# EAGLE design telephon (EAGLE 6.6.0)
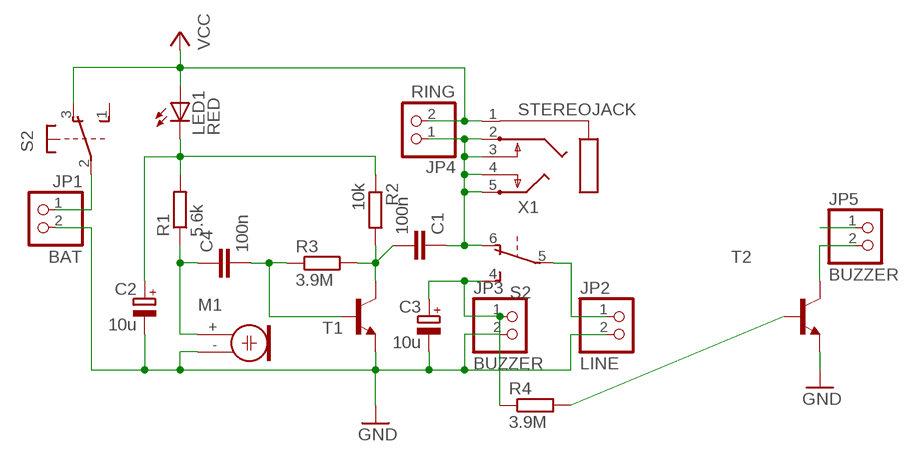
[diagram p0: schematic, sheet 1]

## Parts
C1  100n  C-EU025-025X050  [C025-025X050]
C2  10u  CPOL-EUB45181A  [B45181A]
C3  10u  CPOL-EUB45181A  [B45181A]
C4  100n  C-EU025-025X050  [C025-025X050]
JP1  BAT  PINHD-1X2  [1X02]
JP2  LINE  PINHD-1X2  [1X02]
JP3  BUZZER  PINHD-1X2  [1X02]
JP4  RING  PINHD-1X2  [1X02]
JP5  BUZZER  PINHD-1X2  [1X02]
LED1  RED  LED5MM  [LED5MM]
M1  ELECTRET  [9.7ELECTRET]
R1  5.6k  R-EU_0204/7  [0204/7]
R2  10k  R-EU_0204/7  [0204/7]
R3  3.9M  R-EU_0204/7  [0204/7]
R4  3.9M  R-EU_0204/7  [0204/7]
S2  9450-2  [9450-2]
T1  BC547-NPN-TO92-CBE  [TO92-CBE]
T2  BC547-NPN-TO92-CBE  [TO92-CBE]
X1  STEREOJACK  [STX3100]

## Nets
GND: C2.- C3.- JP1.2 JP2.2 JP3.2 M1.- T1.E T2.E
N$1: C3.+ JP3.1 R4.1 S2.4(2:S)
N$2: JP5.2 T2.C
N$3: R4.2 T2.B
N$4: C4.2 R3.1 T1.B
N$5: C4.1 M1.+ R1.1
N$6: C1.2 R2.2 R3.2 T1.C
N$7: JP5.1
N$8: C1.1 JP4.1 S2.6(2:O) X1.2 X1.3 X1.4 X1.5
N$9: C2.+ LED1.K(C) R1.2 R2.1
N$11: JP2.1 S2.5(2:P)
N$12: JP1.1 S2.2(1:P)
VCC: JP4.2 LED1.A S2.3(1:O) X1.1
Unconnected: S2.1(1:S)

## Library data of the parts
C1 C4 = rcl:C-EU: CAPACITOR, European symbol
C2 C3 = rcl:CPOL-EU: POLARIZED CAPACITOR, European symbol
JP1-JP5 = pinhead:PINHD-1X2: PIN HEADER
LED1 = led:LED: LED OSRAM: - CHIPLED LG R971, LG N971, LY N971, LG Q971, LY Q971, LO R971, LY R971 LH N974, LH R974 LS Q976, LO Q976, LY Q976 LO Q996 - Hyper CHIPLED LW Q18S LB Q993, LB Q99A, LB R99A - SideLED LS A670, LO A670, LY A670, LG A670, LP A670 LB A673, LV A673, LT A673, LW A673 LH A674 LY A675 LS A676, LA A676, LO A676, LY A676, LW A676 LS A679, LY A679, LG A679 - Hyper Micro SIDELED® LS Y876, LA Y876, LO Y876, LY Y876 LT Y87S - SmartLED LW L88C, LW L88S LB L89C, LB L89S, LG L890 LS L89K, LO L89K, LY L89K LS L896, LA L896, LO L896, LY L896 - TOPLED LS T670, LO T670, LY T670, LG T670, LP T670 LSG T670, LSP T670, LSY T670, LOP T670, LYG T670 LG T671, LOG T671, LSG T671 LB T673, LV T673, LT T673, LW T673 LH T674 LS T676, LA T676, LO T676, LY T676, LB T676, LH T676, LSB T676, LW T676 LB T67C, LV T67C, LT T67C, LS T67K, LO T67K, LY T67K, LW E67C LS E67B, LA E67B, LO E67B, LY E67B, LB E67C, LV E67C, LT E67C LW T67C LS T679, LY T679, LG T679 LS T770, LO T770, LY T770, LG T770, LP T770 LB T773, LV T773, LT T773, LW T773 LH T774 LS E675, LA E675, LY E675, LS T675 LS T776, LA T776, LO T776, LY T776, LB T776 LHGB T686 LT T68C, LB T68C - Hyper Mini TOPLED® LB M676 - Mini TOPLED Santana® LG M470 LS M47K, LO M47K, LY M47K Source: http://www.osram.convergy.de LUXEON: - LUMILED® LXK2-PW12-R00, LXK2-PW12-S00, LXK2-PW14-U00, LXK2-PW14-V00 LXK2-PM12-R00, LXK2-PM12-S00, LXK2-PM14-U00 LXK2-PE12-Q00, LXK2-PE12-R00, LXK2-PE12-S00, LXK2-PE14-T00, LXK2-PE14-U00 LXK2-PB12-K00, LXK2-PB12-L00, LXK2-PB12-M00, LXK2-PB14-N00, LXK2-PB14-P00, LXK2-PB14-Q00 LXK2-PR12-L00, LXK2-PR12-M00, LXK2-PR14-Q00, LXK2-PR14-R00 LXK2-PD12-Q00, LXK2-PD12-R00, LXK2-PD12-S00 LXK2-PH12-R00, LXK2-PH12-S00 LXK2-PL12-P00, LXK2-PL12-Q00, LXK2-PL12-R00 Source: www.luxeon.com KINGBRIGHT: KA-3528ASYC Source: www.kingbright.com
M1 = adafruit:ELECTRET: Electret microphone Thru hole 2.54mm spacing with 9.7mm diameter
R1-R4 = rcl:R-EU_: RESISTOR, European symbol
S2 = switch-misc:9450-2: MARQUARDT SWITCH
T1 T2 = transistor:*-NPN-: NPN Transistror BF959 corrected 2008.03.06
X1 = adafruit:STEREOJACK: MIC/HEADPHONE JACK Stereo jack with two switches. Kycon STX3100, CUI SJ1-3555NG and/or 4UCon 05544

## Board
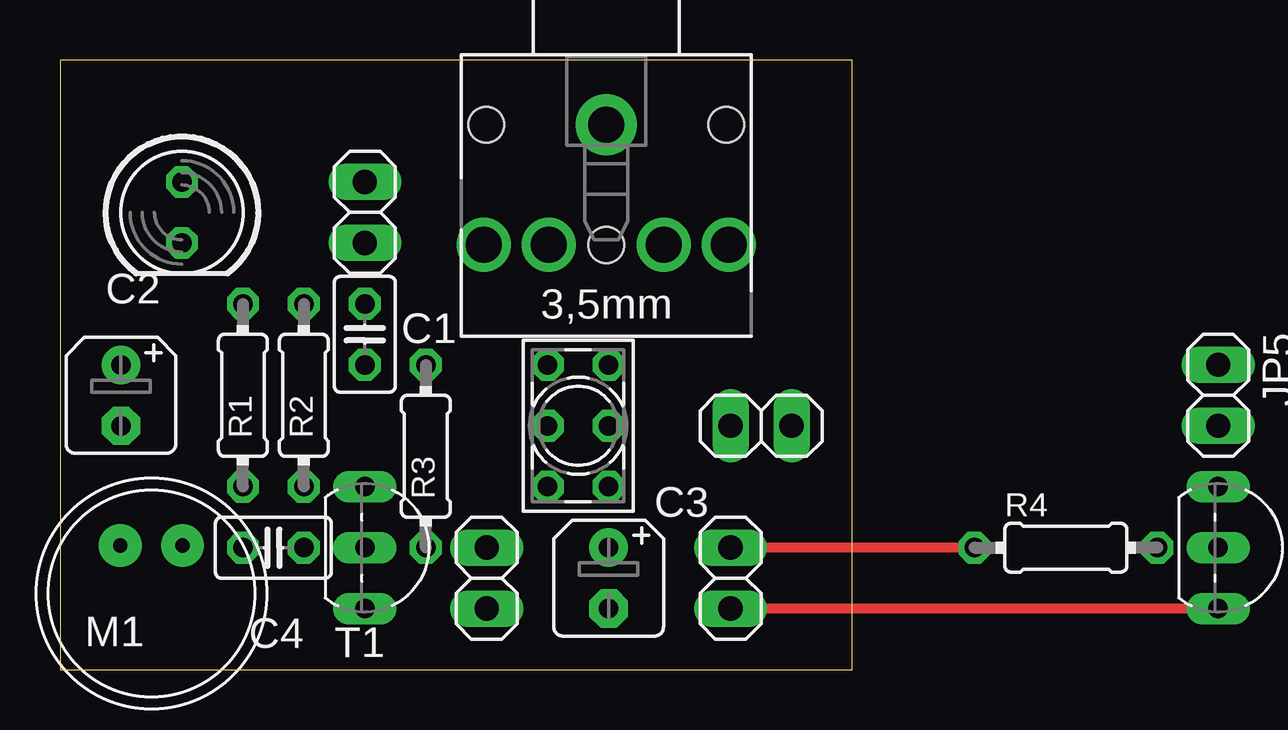
[diagram p1: board, top side]
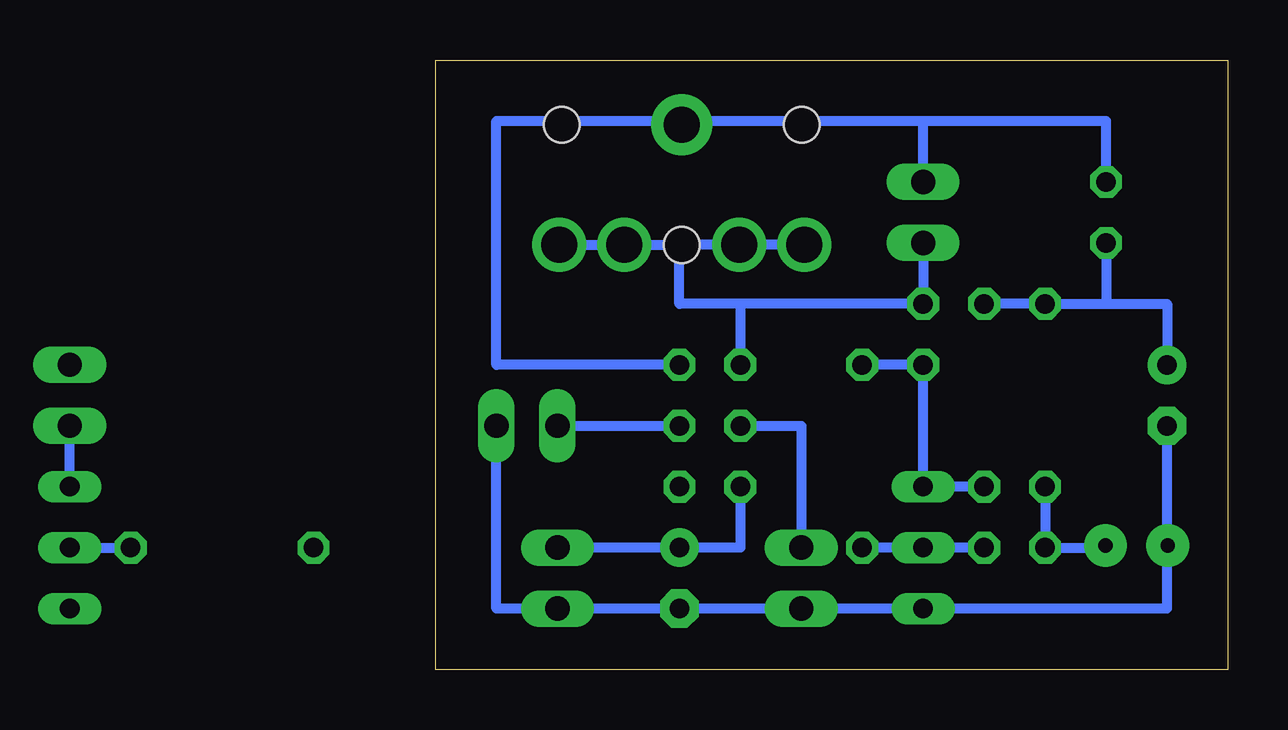
[diagram p2: board, bottom side, seen from below]

Size 33.02 x 25.4 mm. Coordinates in mm from the lower left corner, seen from the top.
Outline: 0,0 33.02,0 33.02,25.4 0,25.4 0,0
Copper layers (1*16): Top 0.035mm / dielectric 1.5mm / Bottom 0.035mm
Design rules "default": minimum track width 10mil, minimum drill 24mil, track to track 8mil, track to pad 8mil, pad to pad 8mil, via to via 8mil, smd to smd 8mil, copper to edge 40mil, drill to drill 8mil, minimum pad ring 10mil, minimum via ring 8mil, stop-mask expansion 4mil, vias tented up to drill 0mil, thermal gap 10mil

### Footprints (pad centres in the part's own frame; a part is rotated, then mirrored left to right if it is on the bottom)
C025-025X050 = drill 0.813 octagon: 1 -1.27,0; 2 1.27,0
B45181A = drill 0.813 pad 1.6: + -1.27,0 | drill 0.813 pad 1.6 octagon: - 1.27,0
1X02 = drill 1.016 long: 1 -1.27,0; 2 1.27,0
LED5MM = drill 0.813 octagon: A -1.27,0; K 1.27,0
9.7ELECTRET = drill 0.6 pad 1.778: + 1.3,2; - -1.3,2
0204/7 = drill 0.813 octagon: 1 -3.81,0; 2 3.81,0
9450-2 = drill 0.813 octagon: 1 -2.54,-1.27; 2 0,-1.27; 3 2.54,-1.27; 4 -2.54,1.27; 5 0,1.27; 6 2.54,1.27
TO92-CBE = drill 0.813 long: B 0,0; C -2.54,0; E 2.54,0
STX3100 = drill 1.5 pad 2.54: 1 2.7,-0.1 | drill 1.5: 2 7.7,5; 3 7.7,2.3; 4 7.7,-2.5; 5 7.7,-5.2 | hole 1.5: 2.7,4.9; 2.7,-5.1; 7.7,-0.1

### Placement (x,y rotation side)
C1  12.7,13.97 270 top
C2  2.54,11.43 270 top
C3  22.86,3.81 270 top
C4  8.89,5.08 0 top
JP1  29.21,10.16 0 top
JP2  17.78,3.81 270 top
JP3  27.94,3.81 270 top
JP4  12.7,19.05 90 top
JP5  48.26,11.43 270 top  (outside the outline)
LED1  5.08,19.05 270 top
M1  3.81,3.17 0 top
R1  7.62,11.43 90 top
R2  10.16,11.43 270 top
R3  15.24,8.89 90 top
R4  41.91,5.08 0 top  (outside the outline)
S2  21.59,10.16 90 top
T1  12.7,5.08 270 top
T2  48.26,5.08 270 top  (outside the outline)
X1  22.86,25.4 270 top

### Tracks (layer width: path | path; a pad name or v marks a point on that pad's centre or on a via)
GND
  Top 0.406: T2.E JP3.2
  Bottom 0.406: 2.54,5.17 2.54,2.54 T1.E JP2.2 C3.- JP3.2 30.48,2.54 JP1.2 | 2.54,5.17 C2.- | M1.- 2.54,5.17
N$1
  Top 0.406: R4.1 JP3.1
  Bottom 0.406: JP3.1 C3.+ 20.32,5.08 S2.4
N$2
  Bottom 0.406: T2.C JP5.2
N$3
  Bottom 0.406: T2.B R4.2
N$4
  Bottom 0.406: R3.1 T1.B C4.2
N$5
  Bottom 0.406: R1.1 C4.1 5.11,5.08 M1.+
N$6
  Bottom 0.406: R3.2 C1.2 T1.C R2.2
N$8
  Bottom 0.406: 22.86,17.7 X1.4 X1.5 | 22.86,17.7 X1.3 X1.2 | 22.86,17.7 22.86,17.78 | 20.32,15.24 C1.1 JP4.1 | 20.32,15.24 S2.6 | 20.32,15.24 22.86,15.24 22.86,17.7
N$9
  Bottom 0.406: R2.1 R1.2 5.08,15.24 | C2.+ 2.54,15.24 5.08,15.24 | LED1.K 5.08,15.24
N$11
  Bottom 0.406: JP2.1 17.78,10.16 S2.5
N$12
  Bottom 0.406: JP1.1 S2.2
VCC
  Bottom 0.406: LED1.A 5.08,22.86 12.7,22.86 | S2.3 30.48,12.7 30.48,22.86 22.76,22.86 | 22.76,22.86 12.7,22.86 | JP4.2 12.7,22.86 | 22.76,22.86 X1.1